# Altium schematic sheet AS5147.SchDoc
size A
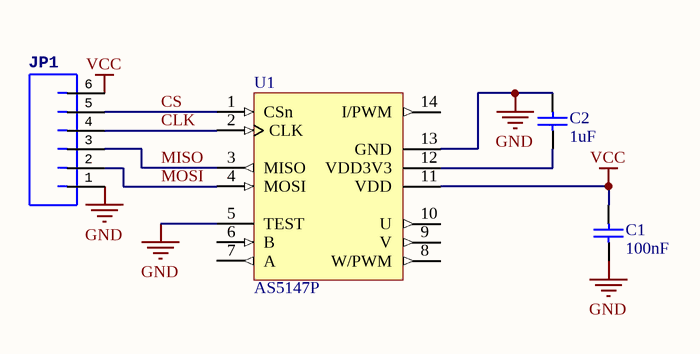
[diagram p0: AS5147.SchDoc]

## Parts
C1  100nF  [CAPC0402(1005)60_L]
C2  1uF  [CAPC0402(1005)60_L]
JP1  (no value)  [JST-6-SMD]
U1  AS5147P  [AMS-TSSOP-14-5000X4400DE_N]

## Nets
GND: C1.1 C2.1 JP1.1 U1.5(TEST) U1.13(GND)
VCC: C1.2 JP1.6 U1.11(VDD)
CLK: JP1.4 U1.2(CLK)
CS: JP1.5 U1.1(CSn)
MISO: JP1.3 U1.3(MISO)
MOSI: JP1.2 U1.4(MOSI)
NetC2_2: C2.2 U1.12(VDD3V3)

Not connected (* = marked no-connect by the designer): U1 6(B) 7(A) 8(W/PWM) 9(V) 10(U) 14(I/PWM)

## Library data of the parts
C1 = CMP-1034-02060-1: CAP 100nF 6.3V ±5% 0402 (1005 Metric) Thickness 0.6mm SMD; Case-EIA: 0402; Tolerance: Â±5%; Case-Metric: 1005; Rated Voltage: 6.3 V; Max Thickness: 0.6 mm; Value: 100nF; Technology: SMT
C2 = CMP-1034-02113-1: CAP 1uF 6.3V ±10% 0402 (1005 Metric) Thickness 0.6mm SMD; Case-Metric: 1005; Case-EIA: 0402; Tolerance: Â±10%; Value: 1uF; Technology: SMT; Rated Voltage: 6.3 V; Max Thickness: 0.6 mm
JP1 = JST_6
U1 = AMS-AS5147P